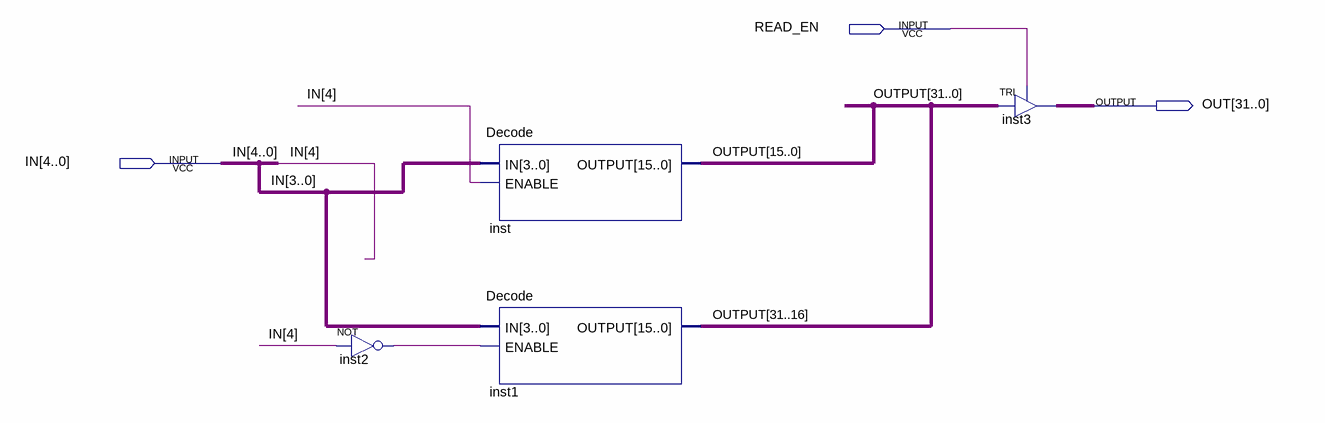
[diagram p0: schematic sheet]
// Quartus schematic read_decode.bdf as structural Verilog: 4 symbols, 3 pins
module read_decode (
  input  READ_EN,
  input  [4:0] IN,
  output [31:0] OUT
);

  wire inst2_out;
  wire [31:0] OUTPUT;

  not inst2 (inst2_out, IN[4]);
  Decode inst (.IN(IN[3:0]), .ENABLE(IN[4]), .OUTPUT(OUTPUT[15:0]));
  Decode inst1 (.IN(IN[3:0]), .ENABLE(inst2_out), .OUTPUT(OUTPUT[31:16]));
  TRI inst3[31:0] (.IN(OUTPUT), .OE(READ_EN), .OUT(OUT));
endmodule
